# Altium schematic sheet NESbot Cart.SchDoc
size Tabloid; PageSetup: Record=PageOptions|CenterHorizontal=True|CenterVertical=True|PrintScale=1.00|XCorrection=1.00|YCorrection=1.00|PrintKind=1|BorderSize=5000000|LeftOffset=0|BottomOffset=0|Orientation=2|PaperLength=1000|PaperWidth=1000|Scale=100|PaperSource=7|PrintQuality=-4|MediaType=1|DitherType=10|PaperKind=Tabloid|PrintScaleMode=1
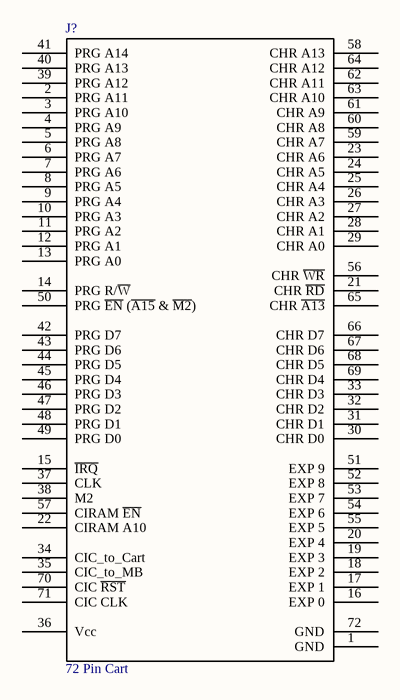
[diagram p0: NESbot Cart.SchDoc]

## Parts
J?  72 Pin Cart  [72 Pin Cart]

## Nets

Not connected (* = marked no-connect by the designer): J? 1(GND) 2(PRG_A11) 3(PRG_A10) 4(PRG_A9) 5(PRG_A8) 6(PRG_A7) 7(PRG_A6) 8(PRG_A5) 9(PRG_A4) 10(PRG_A3) 11(PRG_A2) 12(PRG_A1) 13(PRG_A0) 14(PRG_R/~{W}) 15(~{IRQ}) 16(EXP_0) 17(EXP_1) 18(EXP_2) 19(EXP_3) 20(EXP_4) 21(CHR_~{RD}) 22(CIRAM_A10) 23(CHR_A6) 24(CHR_A5) 25(CHR_A4) 26(CHR_A3) 27(CHR_A2) 28(CHR_A1) 29(CHR_A0) 30(CHR_D0) 31(CHR_D1) 32(CHR_D2) 33(CHR_D3) 34(CIC_to_Cart) 35(CIC_to_MB) 36(Vcc) 37(CLK) 38(M2) 39(PRG_A12) 40(PRG_A13) 41(PRG_A14) 42(PRG_D7) 43(PRG_D6) 44(PRG_D5) 45(PRG_D4) 46(PRG_D3) 47(PRG_D2) 48(PRG_D1) 49(PRG_D0) 50(PRG_~{EN}_(~{A15}_&_~{M2})) 51(EXP_9) 52(EXP_8) 53(EXP_7) 54(EXP_6) 55(EXP_5) 56(CHR_~{WR}) 57(CIRAM_~{EN}) 58(CHR_A13) 59(CHR_A7) 60(CHR_A8) 61(CHR_A9) 62(CHR_A11) 63(CHR_A10) 64(CHR_A12) 65(CHR_~{A13}) 66(CHR_D7) 67(CHR_D6) 68(CHR_D5) 69(CHR_D4) 70(CIC_~{RST}) 71(CIC_CLK) 72(GND)

## Library data of the parts
J? = 72 Pin Cart: 72 Pin Cartridge Connector